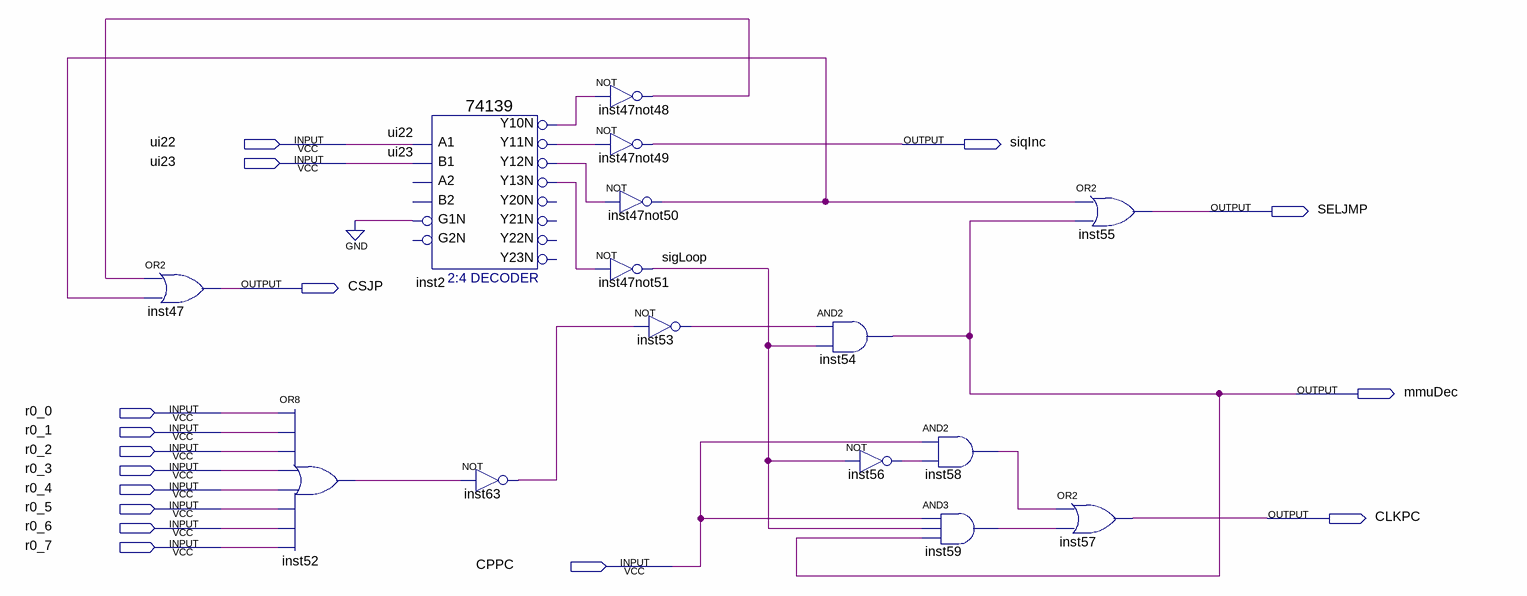
[diagram p0: schematic sheet]
// Quartus schematic CS_IP.bdf as structural Verilog: 15 symbols, 16 pins
module CS_IP (
  input  ui22,
  input  ui23,
  input  r0_0,
  input  r0_1,
  input  r0_2,
  input  r0_3,
  input  r0_4,
  input  r0_5,
  input  r0_6,
  input  r0_7,
  input  CPPC,
  output siqInc,
  output SELJMP,
  output CSJP,
  output mmuDec,
  output CLKPC
);

  wire inst2_y10n, inst2_y11n, inst2_y12n, inst2_y13n, inst47not48_out, inst47not50_out, inst52_out,
       inst53_out, inst56_out, inst58_out, inst59_out, inst63_out, sigLoop;

  or inst47 (CSJP, inst47not48_out, inst47not50_out);
  or inst52 (inst52_out, r0_0, r0_1, r0_2, r0_3, r0_4, r0_5, r0_6, r0_7);
  \74139  inst2 (
    .A1(ui22), .B1(ui23), .G1N(1'b0), .Y10N(inst2_y10n), .Y13N(inst2_y13n), .Y12N(inst2_y12n),
    .Y11N(inst2_y11n));  // open: A2, B2, G2N, Y20N, Y21N, Y22N, Y23N
  not inst63 (inst63_out, inst52_out);
  not inst47not48 (inst47not48_out, inst2_y10n);
  not inst47not49 (siqInc, inst2_y11n);
  not inst47not50 (inst47not50_out, inst2_y12n);
  not inst47not51 (sigLoop, inst2_y13n);
  not inst53 (inst53_out, inst63_out);
  and inst54 (mmuDec, inst53_out, sigLoop);
  not inst56 (inst56_out, sigLoop);
  and inst58 (inst58_out, CPPC, inst56_out);
  and inst59 (inst59_out, CPPC, sigLoop, mmuDec);
  or inst55 (SELJMP, inst47not50_out, mmuDec);
  or inst57 (CLKPC, inst58_out, inst59_out);
endmodule
